# Altium schematic sheet Main.SchDoc
size A4; SheetNumber: 1; SheetTotal: 6
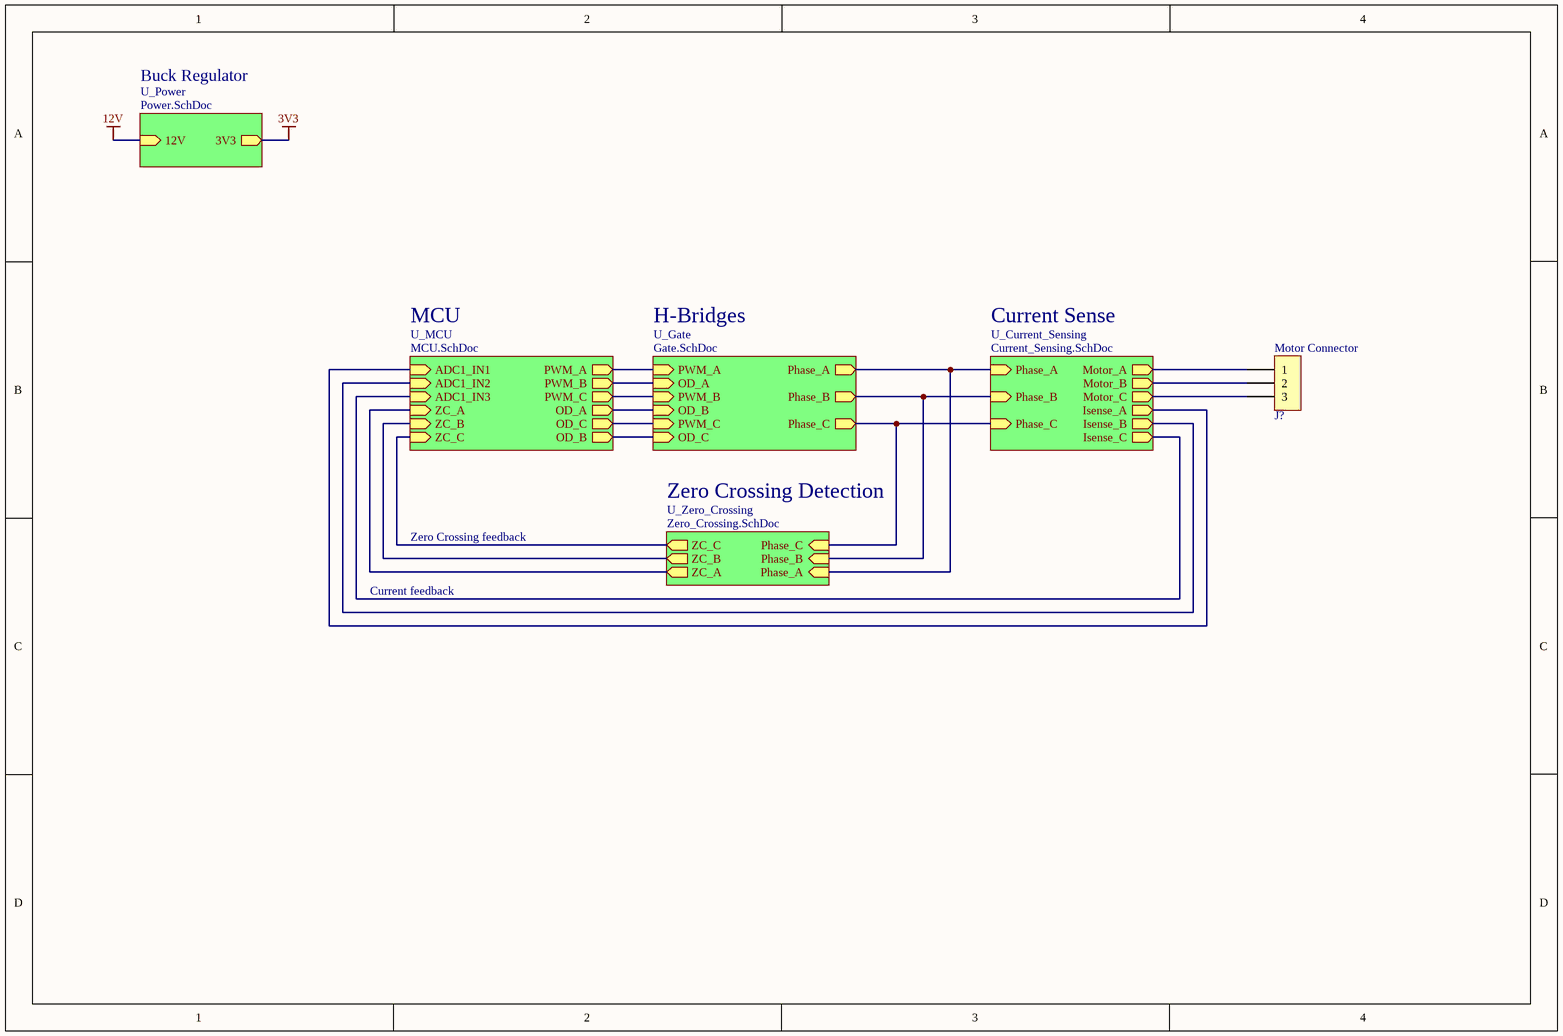
[diagram p0: Main.SchDoc]

## Parts
J?  TB002-500-03BE  [TB002-500-03BE]  (value not drawn)

## Sub-sheets
U_Current_Sensing = Current_Sensing.SchDoc: Phase_A (in), Motor_A (out), Isense_A (out), Phase_B (in), Phase_C (in), Motor_B (out), Motor_C (out), Isense_B (out), Isense_C (out)
U_Gate = Gate.SchDoc: PWM_A (in), OD_A (in), Phase_A (out), PWM_B (in), OD_B (in), Phase_B (out), PWM_C (in), OD_C (in), Phase_C (out)
U_MCU = MCU.SchDoc: ADC1_IN1 (in), ADC1_IN2 (in), ADC1_IN3 (in), PWM_A (out), PWM_B (out), PWM_C (out), OD_A (out), OD_C (out), OD_B (out), ZC_A (in), ZC_B (in), ZC_C (in)
U_Power = Power.SchDoc: 12V (in), 3V3 (out)
U_Zero_Crossing = Zero_Crossing.SchDoc: Phase_A (in), Phase_B (in), Phase_C (in), ZC_A (out), ZC_B (out), ZC_C (out)

## Nets
3V3: sheet U_Power/3V3
12V: sheet U_Power/12V
NetJ?_1: J?.1 ; sheet U_Current_Sensing/Motor_A
NetJ?_2: J?.2 ; sheet U_Current_Sensing/Motor_B
NetJ?_3: J?.3 ; sheet U_Current_Sensing/Motor_C
(unnamed): sheet U_Zero_Crossing/Phase_A, sheet U_Current_Sensing/Phase_A, sheet U_Gate/Phase_A
(unnamed): sheet U_Zero_Crossing/Phase_B, sheet U_Current_Sensing/Phase_B, sheet U_Gate/Phase_B
(unnamed): sheet U_Zero_Crossing/Phase_C, sheet U_Current_Sensing/Phase_C, sheet U_Gate/Phase_C
(unnamed): sheet U_Zero_Crossing/ZC_A, sheet U_MCU/ZC_A
(unnamed): sheet U_Zero_Crossing/ZC_B, sheet U_MCU/ZC_B
(unnamed): sheet U_Zero_Crossing/ZC_C, sheet U_MCU/ZC_C
(unnamed): sheet U_Current_Sensing/Isense_A, sheet U_MCU/ADC1_IN1
(unnamed): sheet U_Current_Sensing/Isense_B, sheet U_MCU/ADC1_IN2
(unnamed): sheet U_Current_Sensing/Isense_C, sheet U_MCU/ADC1_IN3
(unnamed): sheet U_MCU/PWM_A, sheet U_Gate/PWM_A
(unnamed): sheet U_MCU/PWM_B, sheet U_Gate/OD_A
(unnamed): sheet U_MCU/PWM_C, sheet U_Gate/PWM_B
(unnamed): sheet U_MCU/OD_A, sheet U_Gate/OD_B
(unnamed): sheet U_MCU/OD_C, sheet U_Gate/PWM_C
(unnamed): sheet U_MCU/OD_B, sheet U_Gate/OD_C

## Notes on the sheet
- Buck Regulator
- MCU
- H-Bridges
- Current Sense
- (near J?) Motor Connector
- Zero Crossing Detection
- Zero Crossing feedback
- Current feedback

## Library data of the parts
J? = 3PIN_CONNECTOR_5mm: 3 Position Wire to Board Terminal Block Horizontal with Board 0.197" (5.00mm) Through Hole